# EAGLE design PRY417 Gde (EAGLE 9.1.3)
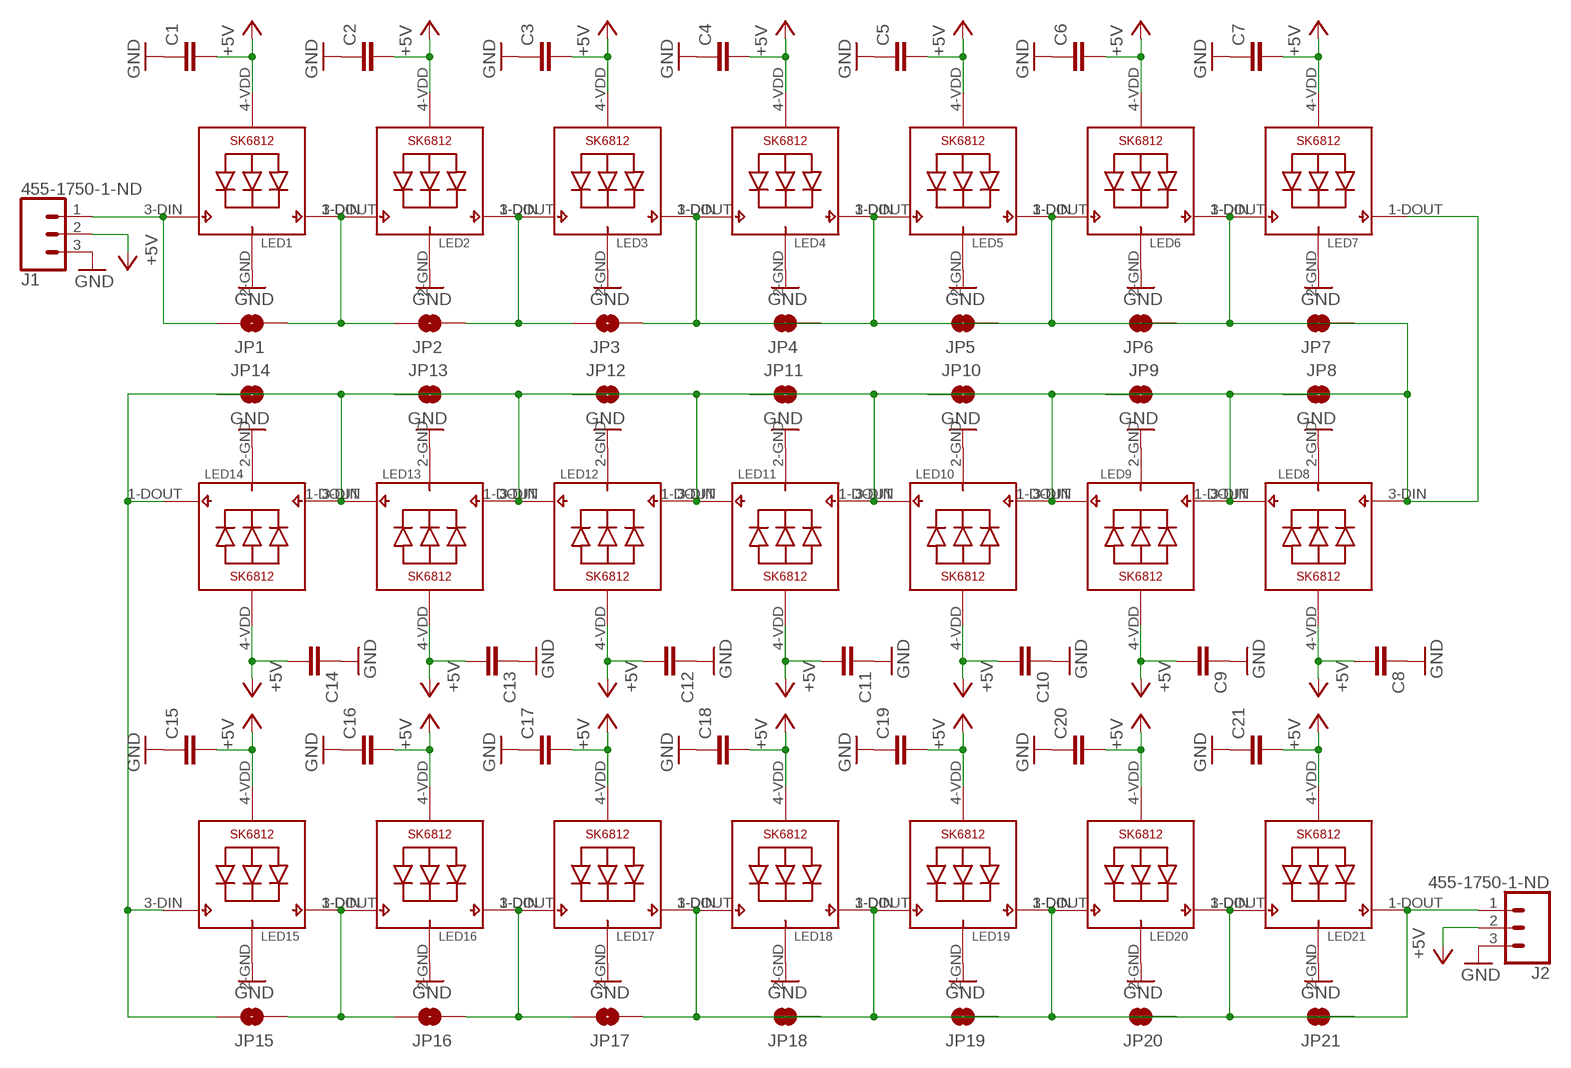
[diagram p0: schematic, sheet 1]

## Parts
C1  C-EUC1206  [C1206]
C2  C-EUC1206  [C1206]
C3  C-EUC1206  [C1206]
C4  C-EUC1206  [C1206]
C5  C-EUC1206  [C1206]
C6  C-EUC1206  [C1206]
C7  C-EUC1206  [C1206]
C8  C-EUC1206  [C1206]
C9  C-EUC1206  [C1206]
C10  C-EUC1206  [C1206]
C11  C-EUC1206  [C1206]
C12  C-EUC1206  [C1206]
C13  C-EUC1206  [C1206]
C14  C-EUC1206  [C1206]
C15  C-EUC1206  [C1206]
C16  C-EUC1206  [C1206]
C17  C-EUC1206  [C1206]
C18  C-EUC1206  [C1206]
C19  C-EUC1206  [C1206]
C20  C-EUC1206  [C1206]
C21  C-EUC1206  [C1206]
J1  455-1750-1-ND  CONN_03  [1X03]
J2  455-1750-1-ND  CONN_03  [1X03]
JP1  JUMPER-SMT_2_NO_SILK  [SMT-JUMPER_2_NO_SILK]
JP2  JUMPER-SMT_2_NO_SILK  [SMT-JUMPER_2_NO_SILK]
JP3  JUMPER-SMT_2_NO_SILK  [SMT-JUMPER_2_NO_SILK]
JP4  JUMPER-SMT_2_NO_SILK  [SMT-JUMPER_2_NO_SILK]
JP5  JUMPER-SMT_2_NO_SILK  [SMT-JUMPER_2_NO_SILK]
JP6  JUMPER-SMT_2_NO_SILK  [SMT-JUMPER_2_NO_SILK]
JP7  JUMPER-SMT_2_NO_SILK  [SMT-JUMPER_2_NO_SILK]
JP8  JUMPER-SMT_2_NO_SILK  [SMT-JUMPER_2_NO_SILK]
JP9  JUMPER-SMT_2_NO_SILK  [SMT-JUMPER_2_NO_SILK]
JP10  JUMPER-SMT_2_NO_SILK  [SMT-JUMPER_2_NO_SILK]
JP11  JUMPER-SMT_2_NO_SILK  [SMT-JUMPER_2_NO_SILK]
JP12  JUMPER-SMT_2_NO_SILK  [SMT-JUMPER_2_NO_SILK]
JP13  JUMPER-SMT_2_NO_SILK  [SMT-JUMPER_2_NO_SILK]
JP14  JUMPER-SMT_2_NO_SILK  [SMT-JUMPER_2_NO_SILK]
JP15  JUMPER-SMT_2_NO_SILK  [SMT-JUMPER_2_NO_SILK]
JP16  JUMPER-SMT_2_NO_SILK  [SMT-JUMPER_2_NO_SILK]
JP17  JUMPER-SMT_2_NO_SILK  [SMT-JUMPER_2_NO_SILK]
JP18  JUMPER-SMT_2_NO_SILK  [SMT-JUMPER_2_NO_SILK]
JP19  JUMPER-SMT_2_NO_SILK  [SMT-JUMPER_2_NO_SILK]
JP20  JUMPER-SMT_2_NO_SILK  [SMT-JUMPER_2_NO_SILK]
JP21  JUMPER-SMT_2_NO_SILK  [SMT-JUMPER_2_NO_SILK]
LED1  SK6812_3535  [LED3535]
LED2  SK6812_3535  [LED3535]
LED3  SK6812_3535  [LED3535]
LED4  SK6812_3535  [LED3535]
LED5  SK6812_3535  [LED3535]
LED6  SK6812_3535  [LED3535]
LED7  SK6812_3535  [LED3535]
LED8  SK6812_3535  [LED3535]
LED9  SK6812_3535  [LED3535]
LED10  SK6812_3535  [LED3535]
LED11  SK6812_3535  [LED3535]
LED12  SK6812_3535  [LED3535]
LED13  SK6812_3535  [LED3535]
LED14  SK6812_3535  [LED3535]
LED15  SK6812_3535  [LED3535]
LED16  SK6812_3535  [LED3535]
LED17  SK6812_3535  [LED3535]
LED18  SK6812_3535  [LED3535]
LED19  SK6812_3535  [LED3535]
LED20  SK6812_3535  [LED3535]
LED21  SK6812_3535  [LED3535]

## Nets
+5V: C1.2 C2.2 C3.2 C4.2 C5.2 C6.2 C7.2 C8.2 C9.2 C10.2 C11.2 C12.2 C13.2 C14.2 C15.2 C16.2 C17.2 C18.2 C19.2 C20.2 C21.2 J1.2 J2.2 LED1.4-VDD(VDD) LED2.4-VDD(VDD) LED3.4-VDD(VDD) LED4.4-VDD(VDD) LED5.4-VDD(VDD) LED6.4-VDD(VDD) LED7.4-VDD(VDD) LED8.4-VDD(VDD) LED9.4-VDD(VDD) LED10.4-VDD(VDD) LED11.4-VDD(VDD) LED12.4-VDD(VDD) LED13.4-VDD(VDD) LED14.4-VDD(VDD) LED15.4-VDD(VDD) LED16.4-VDD(VDD) LED17.4-VDD(VDD) LED18.4-VDD(VDD) LED19.4-VDD(VDD) LED20.4-VDD(VDD) LED21.4-VDD(VDD)
GND: C1.1 C2.1 C3.1 C4.1 C5.1 C6.1 C7.1 C8.1 C9.1 C10.1 C11.1 C12.1 C13.1 C14.1 C15.1 C16.1 C17.1 C18.1 C19.1 C20.1 C21.1 J1.3 J2.3 LED1.2-GND(GND) LED2.2-GND(GND) LED3.2-GND(GND) LED4.2-GND(GND) LED5.2-GND(GND) LED6.2-GND(GND) LED7.2-GND(GND) LED8.2-GND(GND) LED9.2-GND(GND) LED10.2-GND(GND) LED11.2-GND(GND) LED12.2-GND(GND) LED13.2-GND(GND) LED14.2-GND(GND) LED15.2-GND(GND) LED16.2-GND(GND) LED17.2-GND(GND) LED18.2-GND(GND) LED19.2-GND(GND) LED20.2-GND(GND) LED21.2-GND(GND)
N$1: JP1.2 JP2.1 LED1.1-DOUT(DO) LED2.3-DIN(DI)
N$2: JP2.2 JP3.1 LED2.1-DOUT(DO) LED3.3-DIN(DI)
N$3: JP3.2 JP4.2 LED3.1-DOUT(DO) LED4.3-DIN(DI)
N$4: JP4.1 JP5.2 LED4.1-DOUT(DO) LED5.3-DIN(DI)
N$5: JP5.1 JP6.2 LED5.1-DOUT(DO) LED6.3-DIN(DI)
N$6: JP6.1 JP7.2 LED6.1-DOUT(DO) LED7.3-DIN(DI)
N$7: JP8.1 JP9.2 LED8.1-DOUT(DO) LED9.3-DIN(DI)
N$8: JP9.1 JP10.2 LED9.1-DOUT(DO) LED10.3-DIN(DI)
N$9: JP10.1 JP11.2 LED10.1-DOUT(DO) LED11.3-DIN(DI)
N$10: JP11.1 JP12.2 LED11.1-DOUT(DO) LED12.3-DIN(DI)
N$11: JP12.1 JP13.2 LED12.1-DOUT(DO) LED13.3-DIN(DI)
N$12: JP13.1 JP14.2 LED13.1-DOUT(DO) LED14.3-DIN(DI)
N$13: JP7.1 JP8.2 LED7.1-DOUT(DO) LED8.3-DIN(DI)
N$14: J1.1 JP1.1 LED1.3-DIN(DI)
N$15: JP14.1 JP15.1 LED14.1-DOUT(DO) LED15.3-DIN(DI)
N$16: JP15.2 JP16.1 LED15.1-DOUT(DO) LED16.3-DIN(DI)
N$17: JP16.2 JP17.1 LED16.1-DOUT(DO) LED17.3-DIN(DI)
N$18: JP17.2 JP18.2 LED17.1-DOUT(DO) LED18.3-DIN(DI)
N$19: JP18.1 JP19.2 LED18.1-DOUT(DO) LED19.3-DIN(DI)
N$20: JP19.1 JP20.2 LED19.1-DOUT(DO) LED20.3-DIN(DI)
N$21: JP20.1 JP21.2 LED20.1-DOUT(DO) LED21.3-DIN(DI)
N$22: J2.1 JP21.1 LED21.1-DOUT(DO)

## Library data of the parts
C1-C21 = rcl:C-EU: CAPACITOR, European symbol; SPICEPREFIX: C
J1 J2 = SparkFun-Connectors:CONN_03: Multi connection point. Often used as Generic Header-pin footprint for 0.1 inch spaced/style header connections On any of the 0.1 inch spaced packages, you can populate with these: Break Away Headers - Straight <https://www.sparkfun.com/products/116> (PRT-00116) Break Away Male Headers - Right Angle <https://www.sparkfun.com/products/553> (PRT-00553) Female Headers <https://www.sparkfun.com/products/115> (PRT-00115) Break Away Headers - Machine Pin <https://www.sparkfun.com/products/117> (PRT-00117) Break Away Female Headers - Swiss Machine Pin <https://www.sparkfun.com/products/743> (PRT-00743) Stackable Header - 3 Pin (Female, 0.1") <https://www.sparkfun.com/products/13875> (PRT-13875) For SCREWTERMINALS and SPRING TERMINALS visit here: Screw Terimnals on SparkFun.com <https://www.sparkfun.com/search/results?term=Screw+Terminals> (5mm/3.5mm/2.54mm spacing) This device is also useful as a general connection point to wire up your design to another part of your project. Our various solder wires solder well into these plated through hole pads. Hook-Up Wire - Assortment (Stranded, 22 AWG) <https://www.sparkfun.com/products/11375> (PRT-11375) Hook-Up Wire - Assortment (Solid Core, 22 AWG) <https://www.sparkfun.com/products/11367> (PRT-11367) View the entire wire category on our website here <https://www.sparkfun.com/categories/141> Special notes: Molex polarized connector foot print use with SKU : PRT-08232 with associated crimp pins and housings.; PROD_ID: XXX-00000
JP1-JP21 = SparkFun-Jumpers:JUMPER-SMT_2_NO: Normally open jumper This jumper has two pads in close proximity to each other. Apply solder to close the connection. Round pads are easier to solder for beginners, but are a lot larger. SparkFun Product that uses the round pads: SparkFun EL Sequencer <https://www.sparkfun.com/products/12781>
LED1-LED21 = SK6812:SK6812

## Board
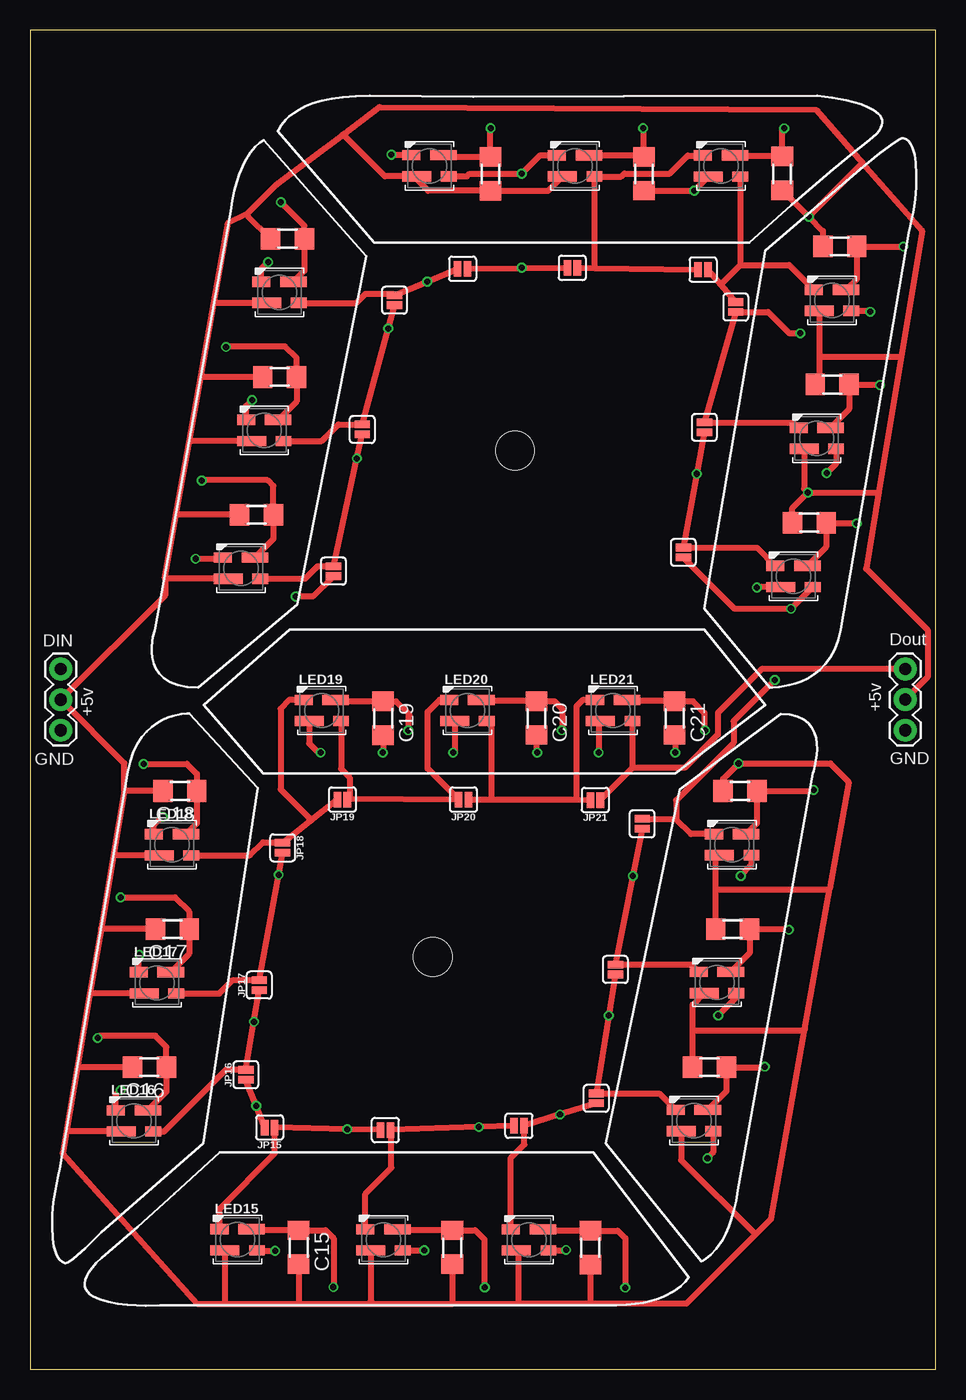
[diagram p1: board, top side]
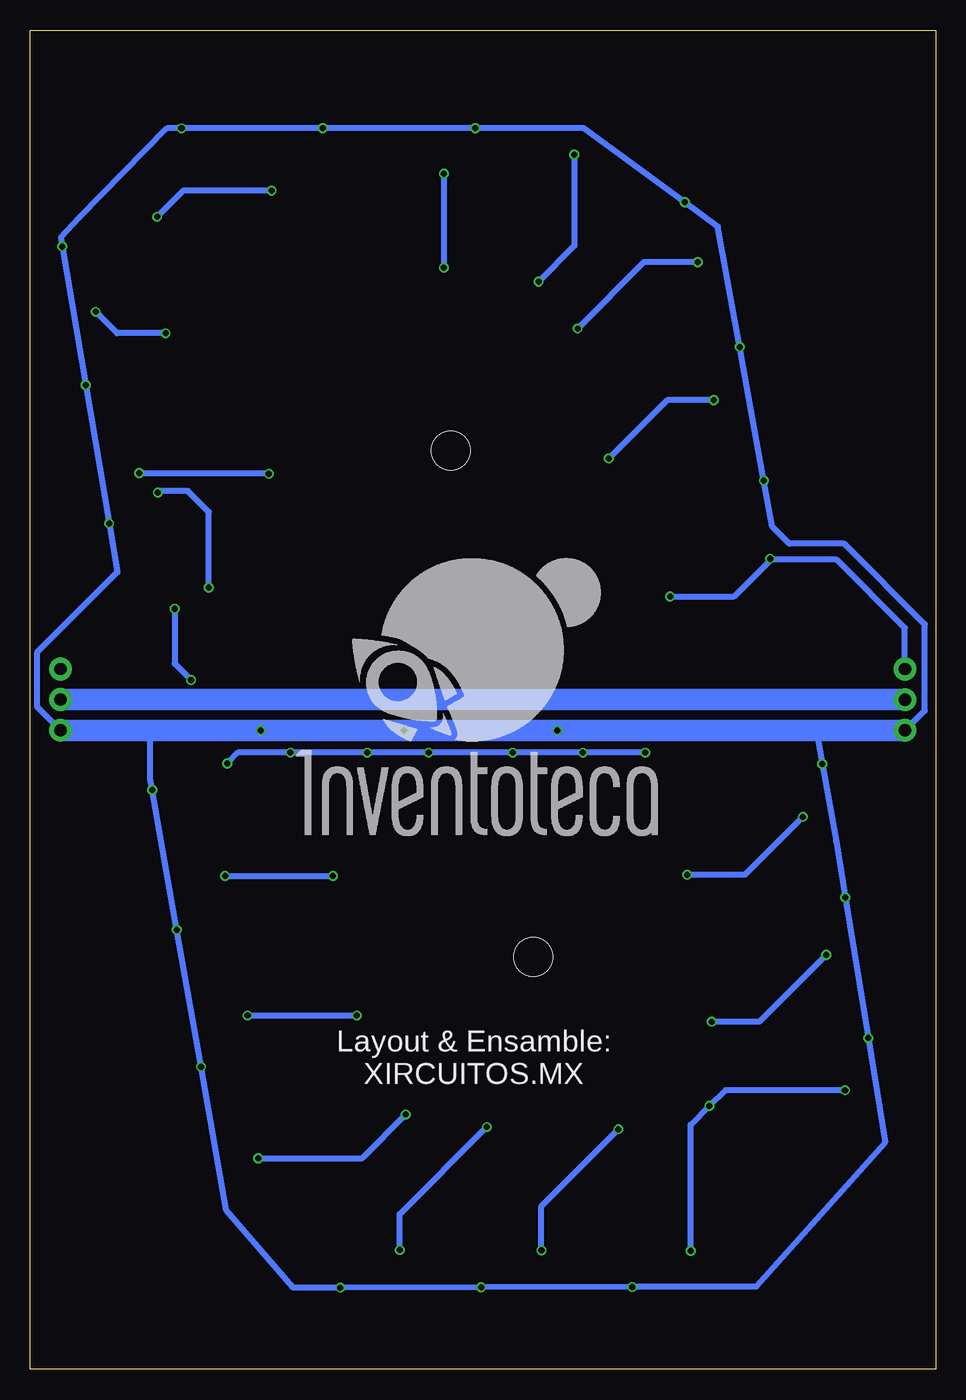
[diagram p2: board, bottom side, seen from below]

Size 74.93 x 110.87 mm. Coordinates in mm from the lower left corner, seen from the top.
Outline: 0,0 74.93,0 74.93,110.87 0,110.87 0,0
Copper layers (1*16): Top 0.035mm / dielectric 1.5mm / Bottom 0.035mm
Design rules "_xircuitos.mx_2L_DRC": minimum track width 6mil, minimum drill 12mil, track to track 6mil, track to pad 6mil, pad to pad 6mil, via to via 6mil, smd to smd 0mil, copper to edge 10mil, drill to drill 12mil, minimum pad ring 10mil, minimum via ring 6mil, stop-mask expansion 2mil, vias tented up to drill 100mil, thermal gap 10mil
Holes 3.2 mm at 40.13,76.07 33.3,34.14

### Footprints (pad centres in the part's own frame; a part is rotated, then mirrored left to right if it is on the bottom)
C1206 = smd 1.6 x 1.8: 1 -1.4,0; 2 1.4,0
1X03 = drill 1.016 pad 1.88: 1 0,0; 2 2.54,0; 3 5.08,0
SMT-JUMPER_2_NO_SILK = smd 0.635 x 1.27: 1 -0.406,0; 2 0.406,0
LED3535 = smd 1.3 x 0.85: 1-DOUT 1.6,-0.875 | smd 2.2 x 0.85: 2-GND 1.15,0.875 | smd 1.5 x 0.85: 3-DIN -1.5,0.875 | smd 2.4 x 0.85: 4-VDD -1.05,-0.875

### Placement (x,y rotation side)
C1  18.74,70.75 180 top
C2  20.65,82.15 180 top
C3  21.29,93.59 180 top
C4  38.09,98.98 270 top
C5  50.8,98.99 270 top
C6  62.24,99.01 270 top
C7  67.01,92.96 180 top
C8  66.38,81.54 180 top
C9  64.48,70.08 180 top
C10  58.74,47.89 180 top
C11  58.14,36.44 180 top
C12  56.22,25.01 180 top
C13  46.36,10.08 270 top
C14  34.92,10.11 270 top
C15  22.21,10.11 270 top
C16  9.88,25.01 180 top
C17  11.76,36.45 180 top
C18  12.39,47.88 180 top
C19  29.2,53.91 270 top
C20  41.9,53.92 270 top
C21  53.33,53.91 270 top
J1  2.53,57.98 270 top
J2  72.42,57.99 270 top
JP1  25.1,66.09 90 top
JP2  27.48,77.82 90 top
JP3  30.15,88.52 90 top
JP4  35.78,91.11 180 top
JP5  44.86,91.19 180 top
JP6  55.69,91.04 180 top
JP7  58.4,87.94 90 top
JP8  55.8,77.99 90 top
JP9  54.06,67.63 90 top
JP10  50.65,45.17 90 top
JP11  48.44,33.1 90 top
JP12  46.85,22.44 90 top
JP13  40.45,20.17 0 top
JP14  29.4,19.81 0 top
JP15  19.82,20.02 180 top
JP16  17.86,24.39 90 top
JP17  18.96,31.81 90 top
JP18  20.89,43.19 270 top
JP19  25.84,47.17 180 top
JP20  35.86,47.17 180 top
JP21  46.77,47.13 180 top
LED1  17.45,66.33 0 top
LED2  19.37,77.73 0 top
LED3  20.63,89.16 0 top
LED4  33.04,99.65 0 top
LED5  45.09,99.63 0 top
LED6  57.17,99.62 0 top
LED7  66.36,88.5 0 top
LED8  65.1,77.08 0 top
LED9  63.17,65.65 0 top
LED10  58.1,43.44 0 top
LED11  56.83,32.03 0 top
LED12  54.93,20.6 0 top
LED13  41.29,10.72 0 top
LED14  29.23,10.72 0 top
LED15  17.17,10.73 0 top
LED16  8.59,20.57 0 top
LED17  10.49,32 0 top
LED18  11.74,43.42 0 top
LED19  24.13,54.54 0 top
LED20  36.18,54.54 0 top
LED21  48.24,54.55 0 top

### Tracks (layer width: path | path; a pad name or v marks a point on that pad's centre or on a via)
+5V  (via drill 0.5)
  Top 0.508: 17.32,70.74 C1.2 12.18,70.75 12.1,70.83 | 19.23,82.17 C2.2 19.23,82.13 14.12,82.13 14.15,82.16 14.15,82.3 | LED1.4-VDD 11.18,65.46 | 11.18,65.46 11.15,65.48 12.1,70.83 | 12.1,70.83 13.2,76.96 | 13.2,76.96 14.15,82.3 | 14.15,82.3 15.2,88.2 | 15.2,88.2 16.41,94.95 18.01,95.71 | LED2.4-VDD 13.31,76.86 13.2,76.96 | LED3.4-VDD 15.29,88.29 15.2,88.2 | C3.2 18.01,95.48 18.01,95.71 | 31.8,98.58 LED4.4-VDD 31.75,98.77 | 18.01,95.71 20.37,98.07 25.89,102.23 | C18.2 7.8,47.88 | 7.8,47.88 6.88,42.51 | 6.88,42.51 5.86,36.51 | 5.86,36.51 4.95,31.13 | 4.95,31.13 3.91,25.02 | 3.91,25.02 3,19.68 | 3,19.68 2.69,17.88 13.84,5.41 16.23,5.41 | 16.23,5.41 22.33,5.42 | 22.33,5.42 28.4,5.43 | 28.4,5.43 35,5.44 | 35,5.44 40.39,5.45 | 40.39,5.45 46.46,5.46 | 46.46,5.46 49.05,5.46 54.33,5.46 60.03,11.16 | 25.89,102.23 28.9,104.5 65.05,104.27 68.87,99.91 | 68.87,99.91 73.81,94.29 72.09,83.86 | 72.09,83.86 70.24,72.65 | 70.24,72.65 69.19,66.29 74.27,61.21 74.27,57.3 J2.2 | 60.03,11.16 61.32,12.45 64.11,28.18 | 64.11,28.18 66.17,39.81 | 66.17,39.81 67.74,48.64 66.22,50.17 v58.62,50.17 57.34,48.88 C10.2 | C17.2 5.92,36.45 5.86,36.51 | LED17.4-VDD 4.96,31.12 4.95,31.13 | C16.2 3.91,25.01 3.91,25.02 | LED16.4-VDD 3.02,19.7 3,19.68 | LED15.4-VDD 16.12,5.53 16.23,5.41 | C15.2 22.21,5.53 22.33,5.42 | LED14.4-VDD 28.18,5.64 28.4,5.43 | C14.2 34.92,5.52 35,5.44 | LED13.4-VDD 40.39,9.69 40.39,5.45 | C13.2 46.36,5.55 46.46,5.46 | LED12.4-VDD 53.88,17.32 60.03,11.16 | C12.2 54.82,28.07 | 54.82,28.07 54.82,30.19 LED11.4-VDD | C11.2 56.74,39.75 | 56.74,39.75 56.74,42.25 LED10.4-VDD | 54.82,28.07 64,28.07 64.11,28.18 | 56.74,39.75 66.12,39.75 66.17,39.81 | 31.75,98.77 29.35,98.77 25.89,102.23
  Top 0.508: C6.2 v64.43,95.42 | v64.43,95.42 65.61,94.24 C7.2 | v64.43,95.42 68.87,99.86 68.87,99.91 | C5.2 v54.96,97.59 LED6.4-VDD | 31.75,98.77 32.94,97.58 C4.2 42.87,97.58 LED5.4-VDD | LED7.4-VDD 65.31,84.02 | 65.31,84.02 65.31,81.88 C8.2 | C9.2 63.08,71.31 v64.36,72.59 | v64.36,72.59 70.18,72.59 70.24,72.65 | LED9.4-VDD 60.2,64.77 v60.15,64.72 | LED8.4-VDD 64.05,72.91 v64.36,72.59 | LED19.4-VDD 23.08,51.83 23.85,51.05 v24.03,51.05 | C19.2 29.2,51.07 v29.18,51.05 | LED20.4-VDD 35.13,51.19 v35,51.05 | C20.2 41.9,51.11 v41.96,51.05 | LED21.4-VDD 47.04,53.52 v47.04,51.05 | C21.2 53.39,52.45 v53.39,51.05 | 7.8,47.88 7.8,50.18 J1.2 11.18,64.08 11.18,65.46 | 65.31,84.02 65.48,83.86 72.09,83.86 | LED18.4-VDD 6.92,42.55 6.88,42.51
  Bottom 0.508: v54.96,97.59 62.26,97.59 v64.43,95.42 | v60.15,64.72 60.15,70.99 61.87,72.72 64.24,72.72 v64.36,72.59 | v24.03,51.05 v29.18,51.05 v35,51.05 v41.96,51.05 v47.04,51.05 v53.39,51.05 57.73,51.05 v58.62,50.17
  Bottom 1.778: J1.2 22.88,55.44 J2.2
GND  (via drill 0.5)
  Top 0.508: LED1.2-GND 20.13,68.75 C1.1 20.13,73.13 19.66,73.61 14.23,73.61 v14.2,73.58 | LED2.2-GND 22.05,80.13 C2.1 22.05,83.74 21.11,84.68 16.24,84.68 v16.2,84.64 | LED3.2-GND 22.69,90.95 C3.1 22.69,94.68 v20.75,96.62 | LED4.2-GND 34.34,100.38 C4.1 v38.09,102.76 v38.1,102.76 | LED5.2-GND 50.68,100.5 C5.1 50.8,102.68 v50.72,102.75 | LED6.2-GND 62.15,100.5 C6.1 62.24,102.57 v62.41,102.74 | LED7.2-GND 68.41,90.28 C7.1 v72.26,92.96 v72.27,92.96 | LED8.2-GND 67.78,79.49 C8.1 70.28,81.54 v70.33,81.49 | LED9.2-GND 65.88,68.08 C9.1 68.36,70.08 v68.4,70.04 | LED21.2-GND 49.5,55.31 C21.1 54.85,55.31 55.8,54.36 55.8,52.96 v55.85,52.91 | LED20.2-GND 37.43,55.32 C20.1 43.39,55.32 44.04,54.66 44.04,52.96 v43.99,52.91 | LED19.2-GND 25.39,55.31 C19.1 30.26,55.31 31.39,54.18 31.29,54.08 v31.29,52.9 | LED10.2-GND 60.14,45.21 C10.1 64.75,47.89 v64.83,47.97 | LED11.2-GND 59.54,34.46 C11.1 62.75,36.44 v62.79,36.4 | LED12.2-GND 57.62,23.02 C12.1 60.75,25.01 v60.79,25.06 | LED13.2-GND 42.55,11.48 C13.1 48.62,11.48 49.25,10.85 v49.25,6.76 | LED14.2-GND 30.47,11.51 C14.1 36.83,11.51 37.59,10.74 37.59,6.81 v37.62,6.79 | LED15.2-GND 18.41,11.51 C15.1 24.45,11.51 25.12,10.85 25.12,6.84 v25.09,6.81 | LED16.2-GND 11.28,22.99 C16.1 11.28,26.7 10.36,27.61 5.76,27.61 v5.58,27.43 | LED17.2-GND 13.16,34.39 C17.1 13.16,37.9 11.98,39.07 v7.48,39.07 | LED18.2-GND 13.79,45.2 C18.1 13.79,49.31 12.97,50.12 v9.38,50.12
  Bottom 0.508: J1.3 0.89,54.54 0.89,61.67 7.57,68.35 12.09,68.35 13.51,69.77 v14.2,73.58 v16.2,84.64 18.01,94.62 v20.75,96.62 29.13,102.77 v38.1,102.76 v50.72,102.75 v62.41,102.74 63.63,102.74 70.87,95.35 72.39,93.68 v72.27,92.96 v70.33,81.49 v68.4,70.04 67.72,65.99 74.37,59.33 74.37,54.86 J2.3 | 9.88,52.9 v9.38,50.12 8.23,43.69 v7.48,39.07 v5.58,27.43 4.17,18.77 14.83,6.83 v25.09,6.81 v37.62,6.79 v49.25,6.76 53.16,6.76 58.7,13.18 v60.79,25.06 v62.79,36.4 v64.83,47.97 65,48.9 | 65,48.9 65,48.95 | 65,48.9 65,52.73 65.18,52.91
  Bottom 1.778: J1.3 9.88,52.9 28.3,52.9 29.41,52.9 v31.29,52.9 v43.99,52.91 v55.85,52.91 65.18,52.91 J2.3
N$1  (via drill 0.5)
  Top 0.508: JP2.1 v27.04,75.41 JP1.2 23.8,66.5 22.76,65.46 LED1.1-DOUT | LED2.3-DIN 17.87,79.75 v18.36,80.24
  Bottom 0.508: v18.36,80.24 22.22,80.24 v27.04,75.41
N$2  (via drill 0.5)
  Top 0.508: JP3.1 v29.63,86.17 JP2.2 27.47,78.23 25.5,78.23 24.12,76.86 LED2.1-DOUT | LED3.3-DIN 19.13,91.11 v19.68,91.67
  Bottom 0.508: v19.68,91.67 24.13,91.67 v29.63,86.17
N$3  (via drill 0.5)
  Top 0.508: JP4.2 v32.85,90.06 JP3.2 30.02,89.05 27.76,89.05 26.99,88.29 LED3.1-DOUT | LED4.3-DIN 29.93,100.52 v29.9,100.56
  Bottom 0.508: v29.9,100.56 29.9,93.02 v32.85,90.06
N$4  (via drill 0.5)
  Top 0.508: JP4.1 40.74,91.16 | 40.74,91.16 JP5.2 | LED4.1-DOUT 36.13,98.77 36.35,98.98 v40.69,98.98 42.21,100.5 LED5.3-DIN | v40.69,91.21 40.74,91.16
  Bottom 0.508: v40.69,98.98 v40.69,91.21
N$5
  Top 0.508: JP5.1 46.71,91.17 | 46.71,91.17 JP6.2 | LED6.3-DIN 54.42,100.5 52.93,99.01 49.17,99.01 48.92,98.75 LED5.1-DOUT 46.69,91.19 46.71,91.17
N$6
  Top 0.508: JP6.1 57.15,89.81 | 57.15,89.81 JP7.2 | LED6.1-DOUT 58.76,91.43 | 58.76,91.43 57.15,89.81 | 58.76,91.43 62.8,91.43 LED7.3-DIN
N$7  (via drill 0.5)
  Top 0.508: JP8.1 v55.17,74.14 JP9.2 60.16,68.03 LED9.3-DIN | LED8.1-DOUT 66.7,74.98 v65.91,74.19
  Bottom 0.508: v65.91,74.19 55.22,74.19 v55.17,74.14
N$8  (via drill 0.5)
  Top 0.508: LED9.1-DOUT v62.97,62.97 58.32,62.97 JP9.1 | LED10.3-DIN 54.7,44.31 53.47,45.54 | 53.47,45.54 50.68,45.54 JP10.2 | v61.62,57.07 58.22,53.67 58.22,51.87 53.47,47.12 53.47,45.54
  Bottom 0.508: v62.97,62.97 62.97,58.42 v61.62,57.07
N$9  (via drill 0.5)
  Top 0.508: JP10.1 v49.88,40.84 JP11.2 54.73,33.51 LED11.3-DIN | LED10.1-DOUT 59.7,41.74 v58.8,40.84
  Bottom 0.508: v58.8,40.84 v49.88,40.84
N$10  (via drill 0.5)
  Top 0.508: JP11.1 v47.89,29.29 JP12.2 52.05,22.85 LED12.3-DIN | LED11.1-DOUT 58.43,30.77 v56.95,29.29
  Bottom 0.508: v56.95,29.29 v47.89,29.29
N$11  (via drill 0.5)
  Top 0.508: JP12.1 v43.85,21.1 JP13.2 40.89,20.13 40.89,18.62 39.79,17.51 LED13.3-DIN | LED12.1-DOUT 56.53,17.94 v56.06,17.48
  Bottom 0.508: v56.06,17.48 47.47,17.48 v43.85,21.1
N$12  (via drill 0.5)
  Top 0.508: JP13.1 v37.13,20.07 JP14.2 29.9,19.73 29.9,16.69 27.73,14.53 LED14.3-DIN | LED13.1-DOUT 44.31,9.84 v44.35,9.88
  Bottom 0.508: v44.35,9.88 44.35,12.85 v37.13,20.07
N$13  (via drill 0.5)
  Top 0.508: LED8.3-DIN 63.15,78.39 JP8.2 JP7.1 61.08,87.54 62.84,85.78 v63.73,85.78 | v69.52,87.55 69.45,87.63 LED7.1-DOUT
  Bottom 0.508: v63.73,85.78 67.74,85.78 v69.52,87.55
N$14  (via drill 0.5)
  Top 0.508: v13.69,67.11 15.85,67.11 LED1.3-DIN | JP1.1 23.4,63.98 v21.97,63.98
  Bottom 0.508: J1.1 2.53,61.38 8.18,67.03 13.61,67.03 | 13.61,67.03 v13.69,67.11 | v21.97,63.98 16.66,63.98 13.61,67.03
N$15  (via drill 0.5)
  Top 0.508: JP14.1 v26.24,19.88 JP15.1 20.22,17.86 15.67,13.31 LED15.3-DIN | LED14.1-DOUT v32.61,9.85 v32.61,9.86
  Bottom 0.508: v32.61,9.86 32.61,13.51 v26.24,19.88
N$16  (via drill 0.5)
  Top 0.508: JP15.2 v18.71,21.81 JP16.1 | LED15.1-DOUT 18.82,9.8 v20.27,9.8 | LED16.3-DIN 7.09,22.71 v7.49,23.11
  Bottom 0.508: v20.27,9.8 20.27,20.25 v18.71,21.81 17.4,23.11 v7.49,23.11
N$17  (via drill 0.5)
  Top 0.508: JP17.1 v18.52,28.78 JP16.2 17.84,24.82 16.2,24.82 11.09,19.7 LED16.1-DOUT | LED17.3-DIN 8.98,34.26 v9.04,34.32
  Bottom 0.508: v9.04,34.32 14.58,28.78 v18.52,28.78
N$18  (via drill 0.5)
  Top 0.508: JP18.2 v20.56,40.95 JP17.2 18.94,32.23 16.76,32.23 15.65,31.12 LED17.1-DOUT | LED18.3-DIN 10.24,45.01 v10.97,45.75
  Bottom 0.508: v10.97,45.75 15.77,40.95 v20.56,40.95
N$19
  Top 0.508: 23.22,45.43 JP18.1 20.85,43.64 19.28,43.64 18.19,42.55 LED18.1-DOUT | 23.22,45.43 JP19.2 | LED19.3-DIN 21.46,55.42 20.73,54.69 20.73,48.01 23.27,45.47 23.26,45.47 23.22,45.43
N$20
  Top 0.508: LED19.1-DOUT 25.73,49.71 26.44,49 26.44,47.37 JP19.1 26.34,47.27 JP20.2 32.89,49.73 32.89,54.43 33.88,55.42 LED20.3-DIN
N$21
  Top 0.508: 45.1,47.17 JP21.2 | JP20.1 38.18,47.17 | 38.18,47.17 45.1,47.17 | LED20.1-DOUT 38.18,53.28 38.18,47.17 | LED21.3-DIN 45.75,55.42 45.21,54.89 45.21,47.28 45.1,47.17
N$22
  Top 0.508: LED21.1-DOUT 49.84,49.8 | 49.84,49.8 JP21.1 | J2.1 60.55,57.99 56.92,54.36 56.92,52.55 54.17,49.8 49.84,49.8

### Text on the board
tPlace: DIN | Dout | +5v | +5v | GND | GND
bPlace: Layout & Ensamble: / XIRCUITOS.MX